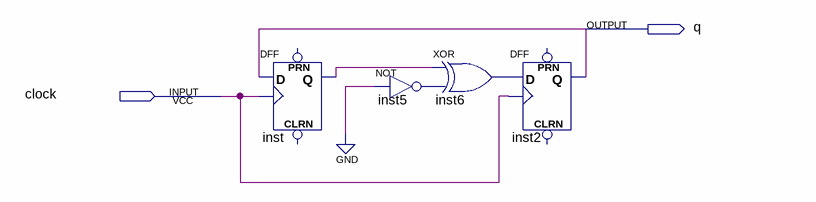
[diagram p0: schematic sheet]
// Quartus schematic test1.bdf as structural Verilog: 4 symbols, 2 pins
module test1 (
  input  clock,
  output q
);

  wire inst5_out, inst6_out, inst_q;

  DFF inst (.CLK(clock), .D(q), .Q(inst_q));  // open: CLRN, PRN
  not inst5 (inst5_out, 1'b0);
  xor inst6 (inst6_out, inst_q, inst5_out);
  DFF inst2 (.CLK(clock), .D(inst6_out), .Q(q));  // open: CLRN, PRN
endmodule
